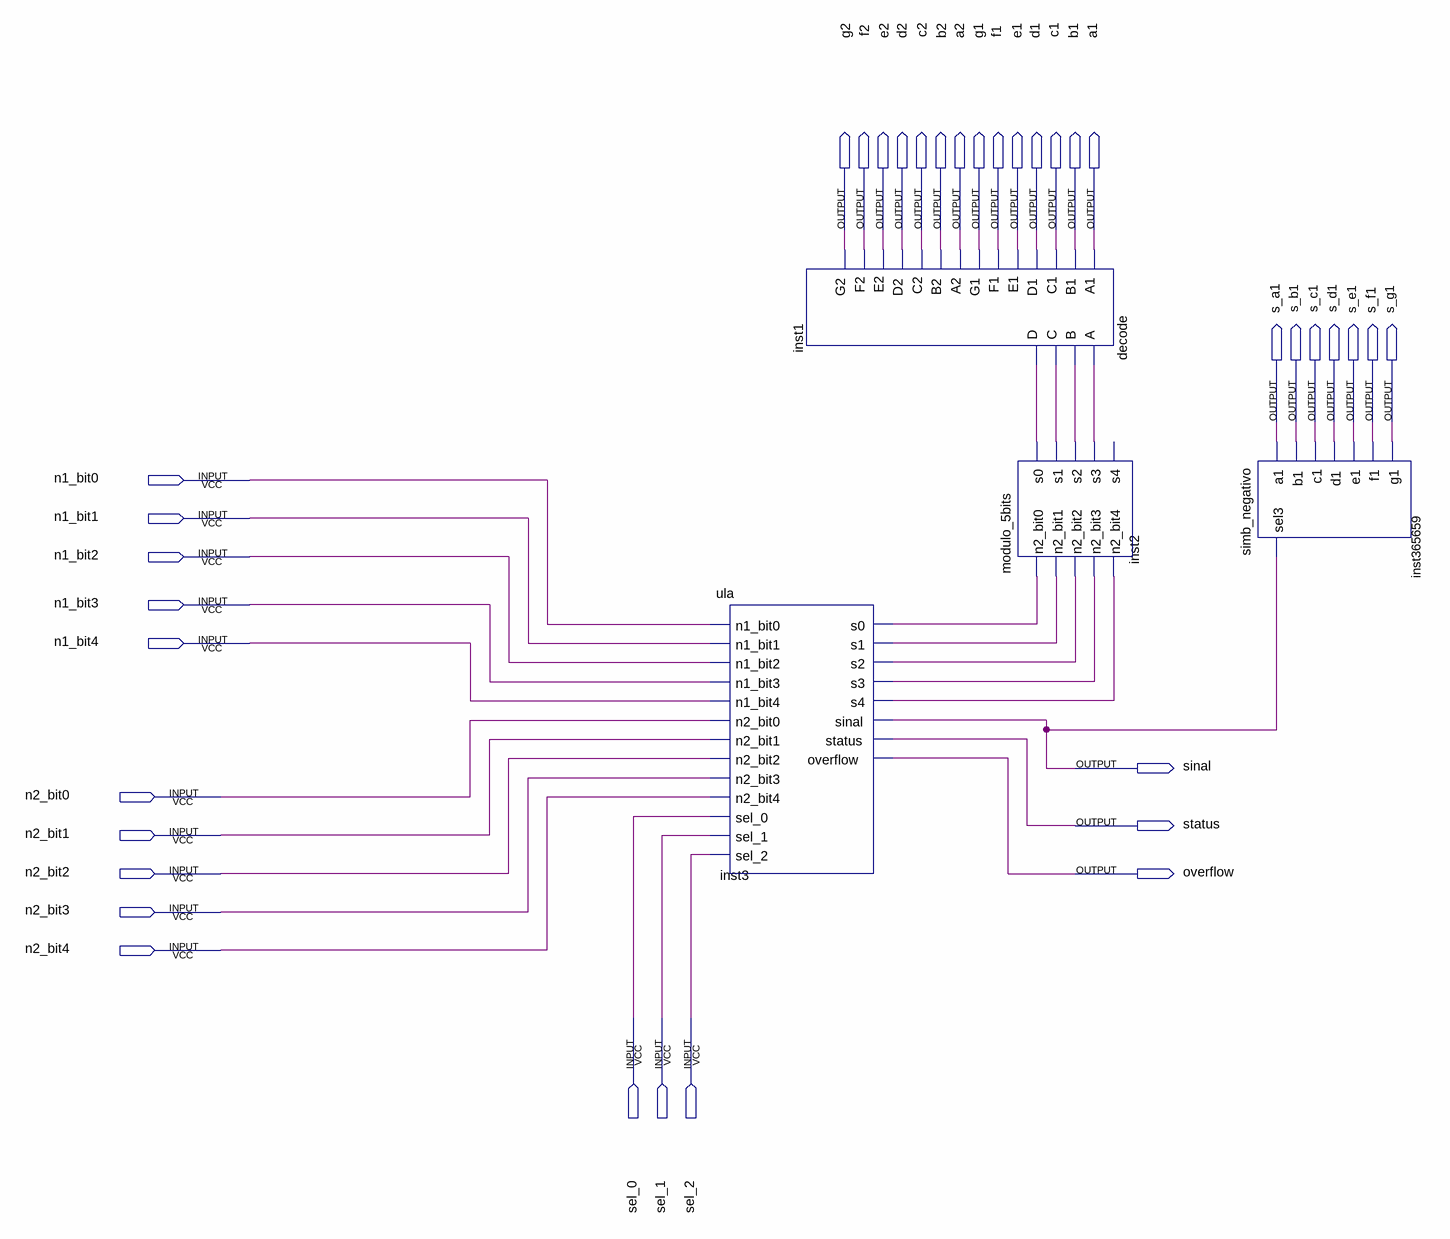
[diagram p0: schematic sheet]
// Quartus schematic projeto_ula.bdf as structural Verilog: 4 symbols, 37 pins
module projeto_ula (
  input  n1_bit0,
  input  n1_bit1,
  input  n1_bit2,
  input  n1_bit3,
  input  n1_bit4,
  input  n2_bit0,
  input  n2_bit1,
  input  n2_bit2,
  input  n2_bit3,
  input  n2_bit4,
  input  sel_0,
  input  sel_1,
  input  sel_2,
  output g2,
  output f2,
  output e2,
  output d2,
  output c2,
  output b2,
  output a2,
  output g1,
  output f1,
  output e1,
  output d1,
  output c1,
  output b1,
  output a1,
  output s_a1,
  output s_b1,
  output s_c1,
  output s_d1,
  output s_e1,
  output s_f1,
  output s_g1,
  output sinal,
  output status,
  output overflow
);

  wire inst2_s0, inst2_s1, inst2_s2, inst2_s3, inst3_s0, inst3_s1, inst3_s2, inst3_s3, inst3_s4;

  ula inst3 (
    .n1_bit0(n1_bit0), .n1_bit1(n1_bit1), .n1_bit2(n1_bit2), .n1_bit3(n1_bit3), .n1_bit4(n1_bit4),
    .n2_bit0(n2_bit0), .n2_bit1(n2_bit1), .n2_bit2(n2_bit2), .n2_bit3(n2_bit3), .n2_bit4(n2_bit4),
    .sel_0(sel_0), .sel_1(sel_1), .sel_2(sel_2), .s0(inst3_s0), .s1(inst3_s1), .s2(inst3_s2), .s3(inst3_s3),
    .s4(inst3_s4), .sinal(sinal), .status(status), .overflow(overflow));
  decode inst1 (
    .A(inst2_s3), .B(inst2_s2), .C(inst2_s1), .D(inst2_s0), .A1(a1), .B1(b1), .C1(c1), .D1(d1), .E1(e1),
    .F1(f1), .G1(g1), .A2(a2), .B2(b2), .C2(c2), .D2(d2), .E2(e2), .F2(f2), .G2(g2));
  modulo_5bits inst2 (
    .n2_bit0(inst3_s0), .n2_bit1(inst3_s1), .n2_bit2(inst3_s2), .n2_bit3(inst3_s3), .n2_bit4(inst3_s4),
    .s0(inst2_s0), .s1(inst2_s1), .s2(inst2_s2), .s3(inst2_s3));  // open: s4
  simb_negativo inst365659 (.sel3(sinal), .a1(s_a1), .b1(s_b1), .c1(s_c1), .d1(s_d1), .e1(s_e1), .f1(s_f1), .g1(s_g1));
endmodule
